# EAGLE schematic Lora_Artemis_schematic (EAGLE 9.6.2)
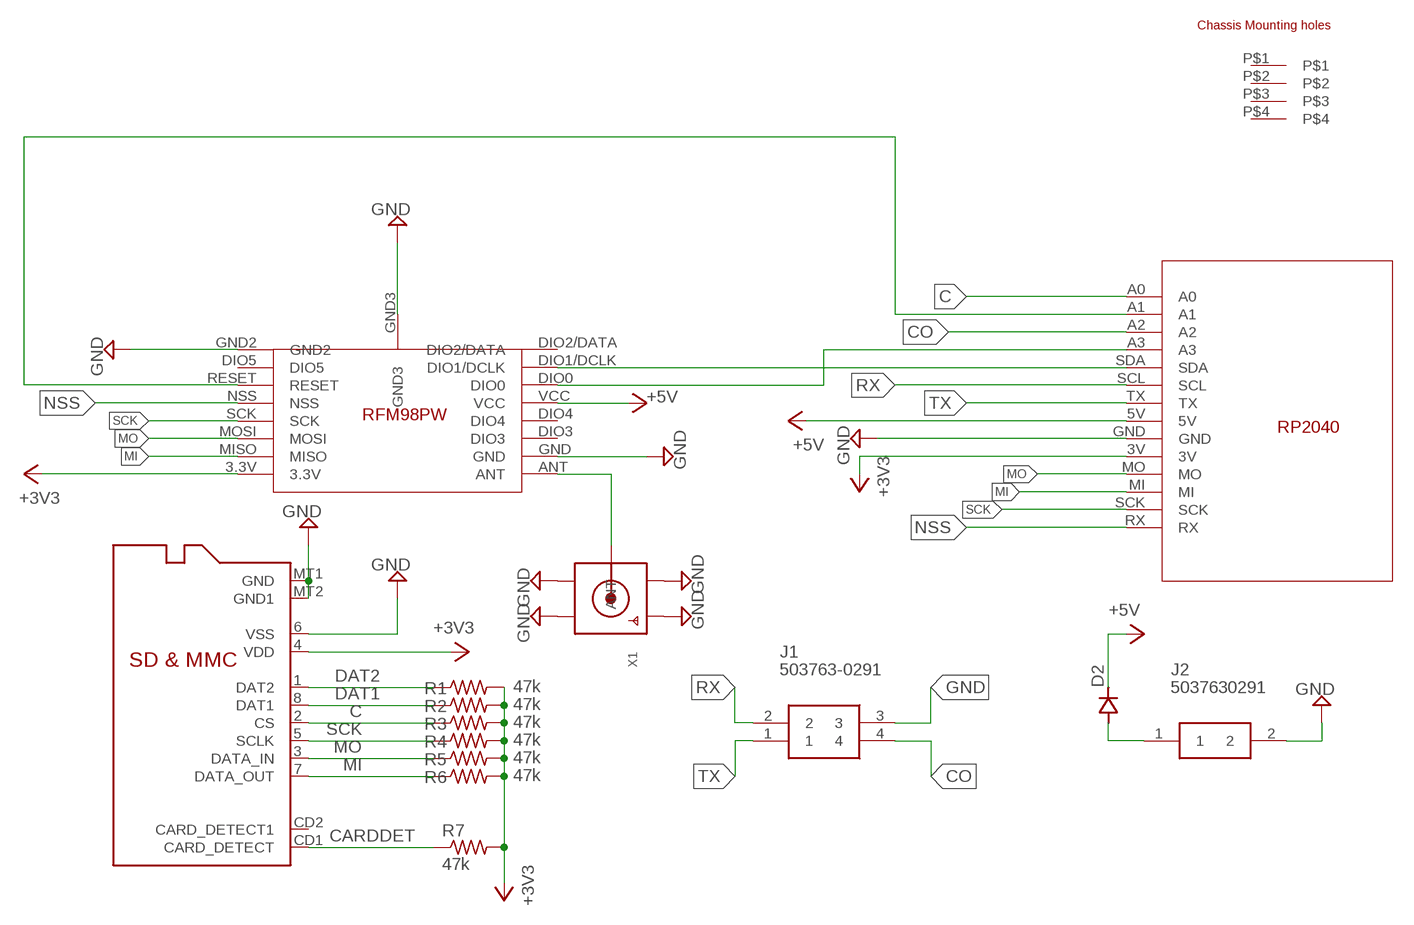
[diagram p0: schematic, sheet 1]

## Parts
D2  DSOD323  [SOD323]
H1  PC104_WCONN_2"  [PC104_WCONN_2]
J1  503763-0291  [5037630291]
J2  5037630291  [5037630291]
R1  47k  R-US_M0805  [M0805]
R2  47k  R-US_M0805  [M0805]
R3  47k  R-US_M0805  [M0805]
R4  47k  R-US_M0805  [M0805]
R5  47k  R-US_M0805  [M0805]
R6  47k  R-US_M0805  [M0805]
R7  47k  R-US_M0805  [M0805]
U$1  QTPY2040  [QTPY2040]
U$2  RFM98PW  [RFM98PW]
U$3  MICROSD  [MICROSD]
X1  SMACONNECTOR  [SMA90_DIP]

## Nets
+3V3: R1.2 R2.2 R3.2 R4.2 R5.2 R6.2 R7.2 U$1.3V U$2.3.3V U$3.4(VDD)
+5V: D2.1(C) U$1.5V U$2.VCC
C: R3.1 U$1.A0 U$3.2(CS)
CARDDET: R7.1 U$3.CD1(CARD_DETECT)
CO: J1.4 U$1.A2
DAT1: R2.1 U$3.8(DAT1)
DAT2: R1.1 U$3.1(DAT2)
GND: J1.3 J2.2 U$1.GND U$2.GND U$2.GND2 U$2.GND3 U$3.6(VSS) U$3.MT1(GND) U$3.MT2(GND1) X1.GND1 X1.GND2 X1.GND3 X1.GND4
MI: R6.1 U$1.MI U$2.MISO U$3.7(DATA_OUT)
MO: R5.1 U$1.MO U$2.MOSI U$3.3(DATA_IN)
N$1: U$1.A1 U$2.RESET
N$2: U$1.A3 U$2.DIO0
N$3: U$1.SDA U$2.DIO1/DCLK
N$4: D2.2(A) J2.1
N$5: U$2.ANT X1.ANTENNA(ANT)
NSS: U$1.RX U$2.NSS
RX: J1.2 U$1.SCL
SCK: R4.1 U$1.SCK U$2.SCK U$3.5(SCLK)
TX: J1.1 U$1.TX
Unconnected: H1.P$1 H1.P$2 H1.P$3 H1.P$4 U$2.DIO2/DATA U$2.DIO3 U$2.DIO4 U$2.DIO5 U$3.CD2(CARD_DETECT1)

## Library data of the parts
D2 = zetex:D: DIODE; MPN: CDSOD323-T05C; OC_FARNELL: 1824860; OC_NEWARK: 79R6078
H1 = HSFL_Main_Library:PC104_WCONN_2
J1 = 503763-0291:503763-0291: Molex Pico-Lock Series, Series Number 503763, 1mm Pitch 2 Way 1 Row Right Angle PCB Header, Solder Termination, 1.5A Source: Datasheet <https://www.molex.com/webdocs/datasheets/pdf/en-us/5037630291_PCB_HEADERS.pdf>; DESCRIPTION: Molex Pico-Lock Series, Series Number 503763, 1mm Pitch 2 Way 1 Row Right Angle PCB Header, Solder Termination, 1.5A; HEIGHT: 1mm; MANUFACTURER_NAME: Molex; MANUFACTURER_PART_NUMBER: 503763-0291; MOUSER_PART_NUMBER: 538-503763-0291; MOUSER_PRICE-STOCK: https://www.mouser.co.uk/ProductDetail/Molex/503763-0291?qs=zwvsCB%2Fxu0fkT4t0xocxIQ%3D%3D
J2 = 5037630291:5037630291: 1.00mm Pitch, Pico-Lock PCB Header, Single Row, Right-Angle, Surface Mount, Gold over Nickel Plating, Positive Lock, 2 Circuits, Tape and Reel Source: Datasheet <https://www.molex.com/pdm_docs/sd/5037630291_sd.pdf>; ARROW_PART_NUMBER: 5037630291; ARROW_PRICE-STOCK: https://www.arrow.com/en/products/503763-0291/molex; DESCRIPTION: 1.00mm Pitch, Pico-Lock PCB Header, Single Row, Right-Angle, Surface Mount, Gold over Nickel Plating, Positive Lock, 2 Circuits, Tape and Reel; HEIGHT: 1.5mm; MANUFACTURER_NAME: Molex; MANUFACTURER_PART_NUMBER: 5037630291
R1-R7 = adafruit:R-US_: RESISTOR, American symbol
U$1 = QTPY2040 v5:QTPY2040
U$2 = RFM98PW v5:RFM98PW
U$3 = adafruit:MICROSD: Micro-SD / Transflash card holder with SPI pinout For the 3M # 2908-05WB-MG and/or 4UCON #19656 push-push type
X1 = adafruit:SMACONNECTOR: SMA Connector 90° DIP SMA Connector, 50 Ohm (4UConnector: 07259)